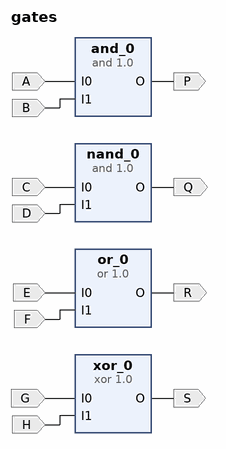
[diagram p0: block diagram of the top level]
# Vivado block design gates, xc7a35tcpg236-1, Vivado 2018.2.1
create_bd_design gates

create_bd_port -dir I -type data A
create_bd_port -dir I -type data B
create_bd_port -dir O -type data P
create_bd_port -dir I -type data E
create_bd_port -dir I -type data F
create_bd_port -dir O -type data R
create_bd_port -dir I -type data C
create_bd_port -dir I -type data D
create_bd_port -dir O -type data Q
create_bd_port -dir I -type data G
create_bd_port -dir I -type data H
create_bd_port -dir O -type data S

create_bd_cell -type ip -vlnv FIT:user:and:1.0 and_0
create_bd_cell -type ip -vlnv FIT:user:and:1.0 nand_0
set_property -dict {CONFIG.O_inverted true} [get_bd_cells nand_0]
create_bd_cell -type ip -vlnv FIT:user:or:1.0 or_0
create_bd_cell -type ip -vlnv FIT:user:xor:1.0 xor_0

# ---- connections ----

connect_bd_net -net I0_0_1 [get_bd_ports A] [get_bd_pins and_0/I0]
connect_bd_net -net I1_0_1 [get_bd_ports B] [get_bd_pins and_0/I1]
connect_bd_net [get_bd_pins and_0/O] [get_bd_ports P]
connect_bd_net -net I0_1_1 [get_bd_ports E] [get_bd_pins or_0/I0]
connect_bd_net -net I1_1_1 [get_bd_ports F] [get_bd_pins or_0/I1]
connect_bd_net [get_bd_pins or_0/O] [get_bd_ports R]
connect_bd_net -net I0_2_1 [get_bd_ports C] [get_bd_pins nand_0/I0]
connect_bd_net -net I1_2_1 [get_bd_ports D] [get_bd_pins nand_0/I1]
connect_bd_net [get_bd_pins nand_0/O] [get_bd_ports Q]
connect_bd_net -net I0_3_1 [get_bd_ports G] [get_bd_pins xor_0/I0]
connect_bd_net -net I1_3_1 [get_bd_ports H] [get_bd_pins xor_0/I1]
connect_bd_net [get_bd_pins xor_0/O] [get_bd_ports S]

validate_bd_design
save_bd_design
